# EAGLE schematic HarpyFC (EAGLE 9.5.1)

## Sheet 1 of 2
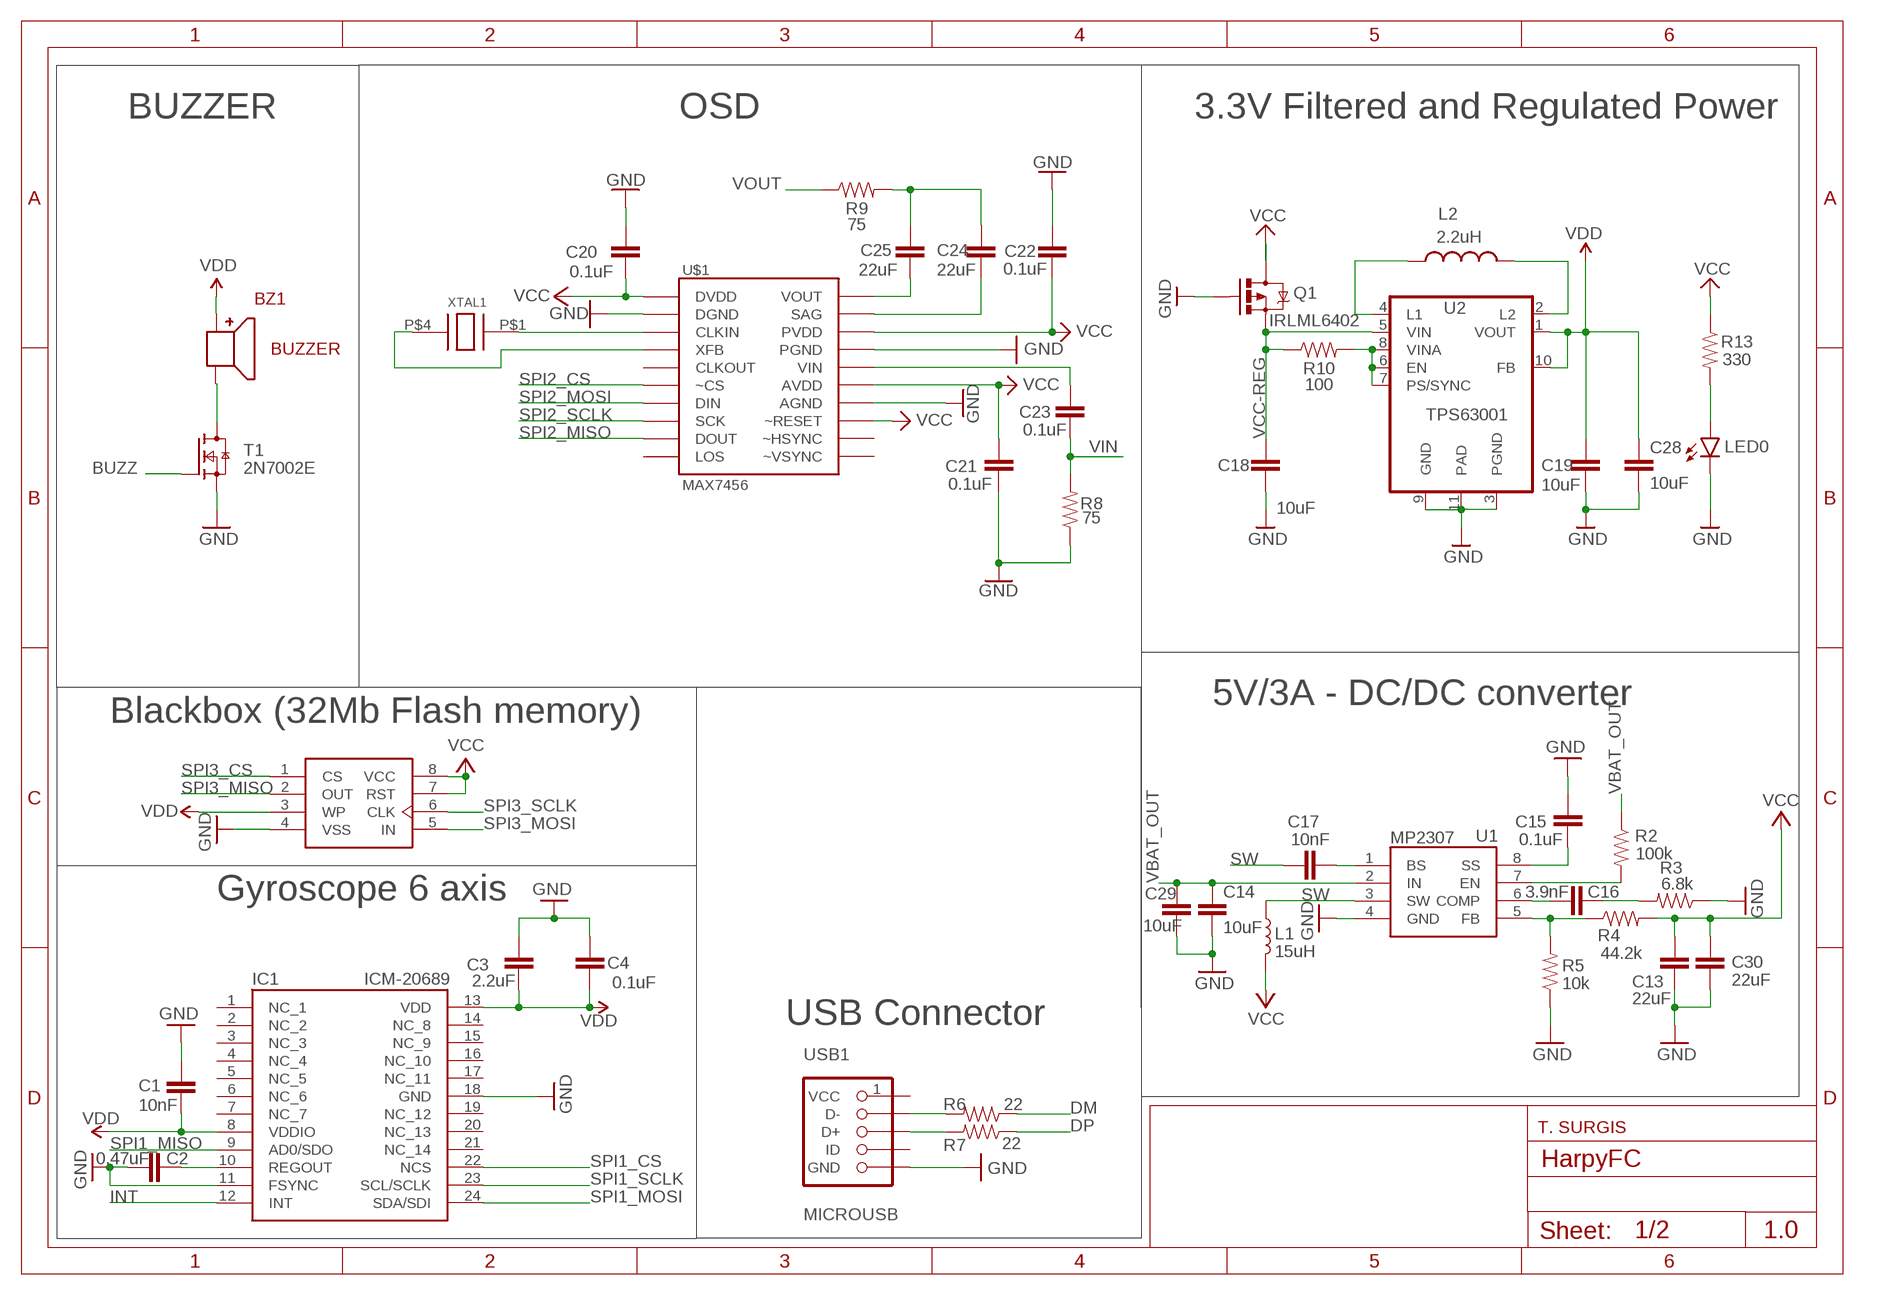
[diagram p0: schematic, sheet 1]

### Parts
BZ1  BUZZER  [CMT-8530S-SMT-TR]
C1  10nF  CAP-0402-TIGHT  [0402-TIGHT]
C2  0.47uF  CAP-0402-TIGHT  [0402-TIGHT]
C3  2.2uF  CAP-0603  [0603]
C4  0.1uF  CAP-0402-TIGHT  [0402-TIGHT]
C13  22uF  CAP-0603  [0603]
C14  10uF  CAP-0603  [0603]
C15  0.1uF  CAP-0402-TIGHT  [0402-TIGHT]
C16  3.9nF  CAP-0402-TIGHT  [0402-TIGHT]
C17  10nF  CAP-0402-TIGHT  [0402-TIGHT]
C18  10uF  CAP-0603  [0603]
C19  10uF  CAP-0603  [0603]
C20  0.1uF  CAP-0402-TIGHT  [0402-TIGHT]
C21  0.1uF  CAP-0402-TIGHT  [0402-TIGHT]
C22  0.1uF  CAP-0402-TIGHT  [0402-TIGHT]
C23  0.1uF  CAP-0402-TIGHT  [0402-TIGHT]
C24  22uF  CAP-0805  [0805]
C25  22uF  CAP-0805  [0805]
C28  10uF  CAP-0603  [0603]
C29  10uF  CAP-0603  [0603]
C30  22uF  CAP-0603  [0603]
IC1  ICM-20689  [ICM20689]
L1  15uH  MPIL0630  [MPIL0630]
L2  2.2uH  DFE201612E-INDUCTOR2.2UH  [DFE201612E-INDUCTOR]
LED0  BLUE  LED  [0805]
Q1  MOSFET-PCHANNEL  [SOT23-3]
R2  100k  RESISTOR  [0402-TIGHT]
R3  6.8k  RESISTOR  [0402-TIGHT]
R4  44.2k  RESISTOR  [0402-TIGHT]
R5  10k  RESISTOR  [0402-TIGHT]
R6  22  RESISTOR  [0402-TIGHT]
R7  22  RESISTOR  [0402-TIGHT]
R8  75  RESISTOR  [0402-TIGHT]
R9  75  RESISTOR  [0402-TIGHT]
R10  100  RESISTOR  [0402-TIGHT]
R13  330  RESISTOR  [0402-TIGHT]
T1  2N7002E  [SOT23]
U1  MP2307  [SOIC8]
U2  TPS63001  TPS630XX-TPS63001  [VSON-N10]
U3  MX25L6406EM2I-12G  M25P32  [M25P32]
U$1  MAX7456  [TSSOP28]
USB1  MICROUSB  [1051330011-SD]
XTAL1  CRYSTAL  [SX32Y027000BA1T]

### Nets
BUZZ: T1.1(G) ; also sheet 2
DM: R6.1 ; also sheet 2
DP: R7.1 ; also sheet 2
GND: C1.1 C2.1 C3.2 C4.2 C13.2 C14.2 C15.2 C18.2 C19.2 C20.2 C21.2 C22.2 C28.2 C29.2 C30.2 IC1.11(FSYNC) IC1.18(GND) LED0.2(C) Q1.1(G) R3.1 R5.1 R8.1 T1.2(S) U1.4(GND) U2.3(PGND) U2.9(GND) U2.11(PAD) U3.4(VSS) U$1.4(DGND) U$1.20(AGND) U$1.23(PGND) USB1.5(GND) USB1.HOLE3(GND) USB1.HOLE4(GND) USB1.HOLE5(GND) ; also sheet 2
INT: IC1.12(INT) ; also sheet 2
L1: L2.P$1 U2.4(L1)
L2: L2.P$2 U2.2(L2)
N$2: C2.2 IC1.10(REGOUT)
N$3: R10.2 U2.6(EN) U2.7(PS/SYNC) U2.8(VINA)
N$13: R2.2 U1.7(EN)
N$14: C15.1 U1.8(SS)
N$15: C16.2 U1.6(COMP)
N$16: C16.1 R3.2
N$17: R4.1 R5.2 U1.5(FB)
N$18: C17.2 U1.1(BS)
N$19: R6.2 USB1.2(D-)
N$20: R7.2 USB1.3(D+)
N$21: BZ1.P$3 T1.3(D)
N$22: U$1.5(CLKIN) XTAL1.P$1
N$23: U$1.6(XFB) XTAL1.P$4
N$26: C23.2 U$1.22(VIN)
N$27: C24.2 U$1.25(SAG)
N$28: C25.2 U$1.26(VOUT)
N$29: C24.1 C25.1 R9.2
N$32: LED0.1(A) R13.2
SPI1_CS: IC1.22(NCS) ; also sheet 2
SPI1_MISO: IC1.9(AD0/SDO) ; also sheet 2
SPI1_MOSI: IC1.24(SDA/SDI) ; also sheet 2
SPI1_SCLK: IC1.23(SCL/SCLK) ; also sheet 2
SPI2_CS: U$1.8(~CS) ; also sheet 2
SPI2_MISO: U$1.11(DOUT) ; also sheet 2
SPI2_MOSI: U$1.9(DIN) ; also sheet 2
SPI2_SCLK: U$1.10(SCK) ; also sheet 2
SPI3_CS: U3.1(CS) ; also sheet 2
SPI3_MISO: U3.2(OUT) ; also sheet 2
SPI3_MOSI: U3.5(IN) ; also sheet 2
SPI3_SCLK: U3.6(CLK) ; also sheet 2
SW: C17.1 L1.P$1 U1.3(SW)
VBAT_OUT: C14.1 C29.1 R2.1 U1.2(IN) ; also sheet 2
VCC: C13.1 C20.1 C21.1 C22.1 C30.1 L1.P$2 Q1.3(D) R4.2 R13.1 U3.7(RST) U3.8(VCC) U$1.3(DVDD) U$1.19(~RESET) U$1.21(AVDD) U$1.24(PVDD) ; also sheet 2
VCC-REG: C18.1 Q1.2(S) R10.1 U2.5(VIN)
VDD: BZ1.P$4 C1.2 C3.1 C4.1 C19.1 C28.1 IC1.8(VDDIO) IC1.13(VDD) U2.1(VOUT) U2.10(FB) U3.3(WP) ; also sheet 2
VIN: C23.1 R8.2 ; also sheet 2
VOUT: R9.1 ; also sheet 2
Unconnected: IC1.1(NC_1) IC1.2(NC_2) IC1.3(NC_3) IC1.4(NC_4) IC1.5(NC_5) IC1.6(NC_6) IC1.7(NC_7) IC1.14(NC_8) IC1.15(NC_9) IC1.16(NC_10) IC1.17(NC_11) IC1.19(NC_12) IC1.20(NC_13) IC1.21(NC_14) U$1.7(CLKOUT) U$1.12(LOS) U$1.17(~VSYNC) U$1.18(~HSYNC) USB1.1(VCC) USB1.4(ID)

### Notes on the sheet
- BUZZER | OSD | 3.3V Filtered and Regulated Power
- IRLML6402
- 5V/3A - DC/DC converter
- Blackbox (32Mb Flash memory)
- MP2307
- Gyroscope 6 axis
- USB Connector
- T. SURGIS
- 1.0

## Sheet 2 of 2
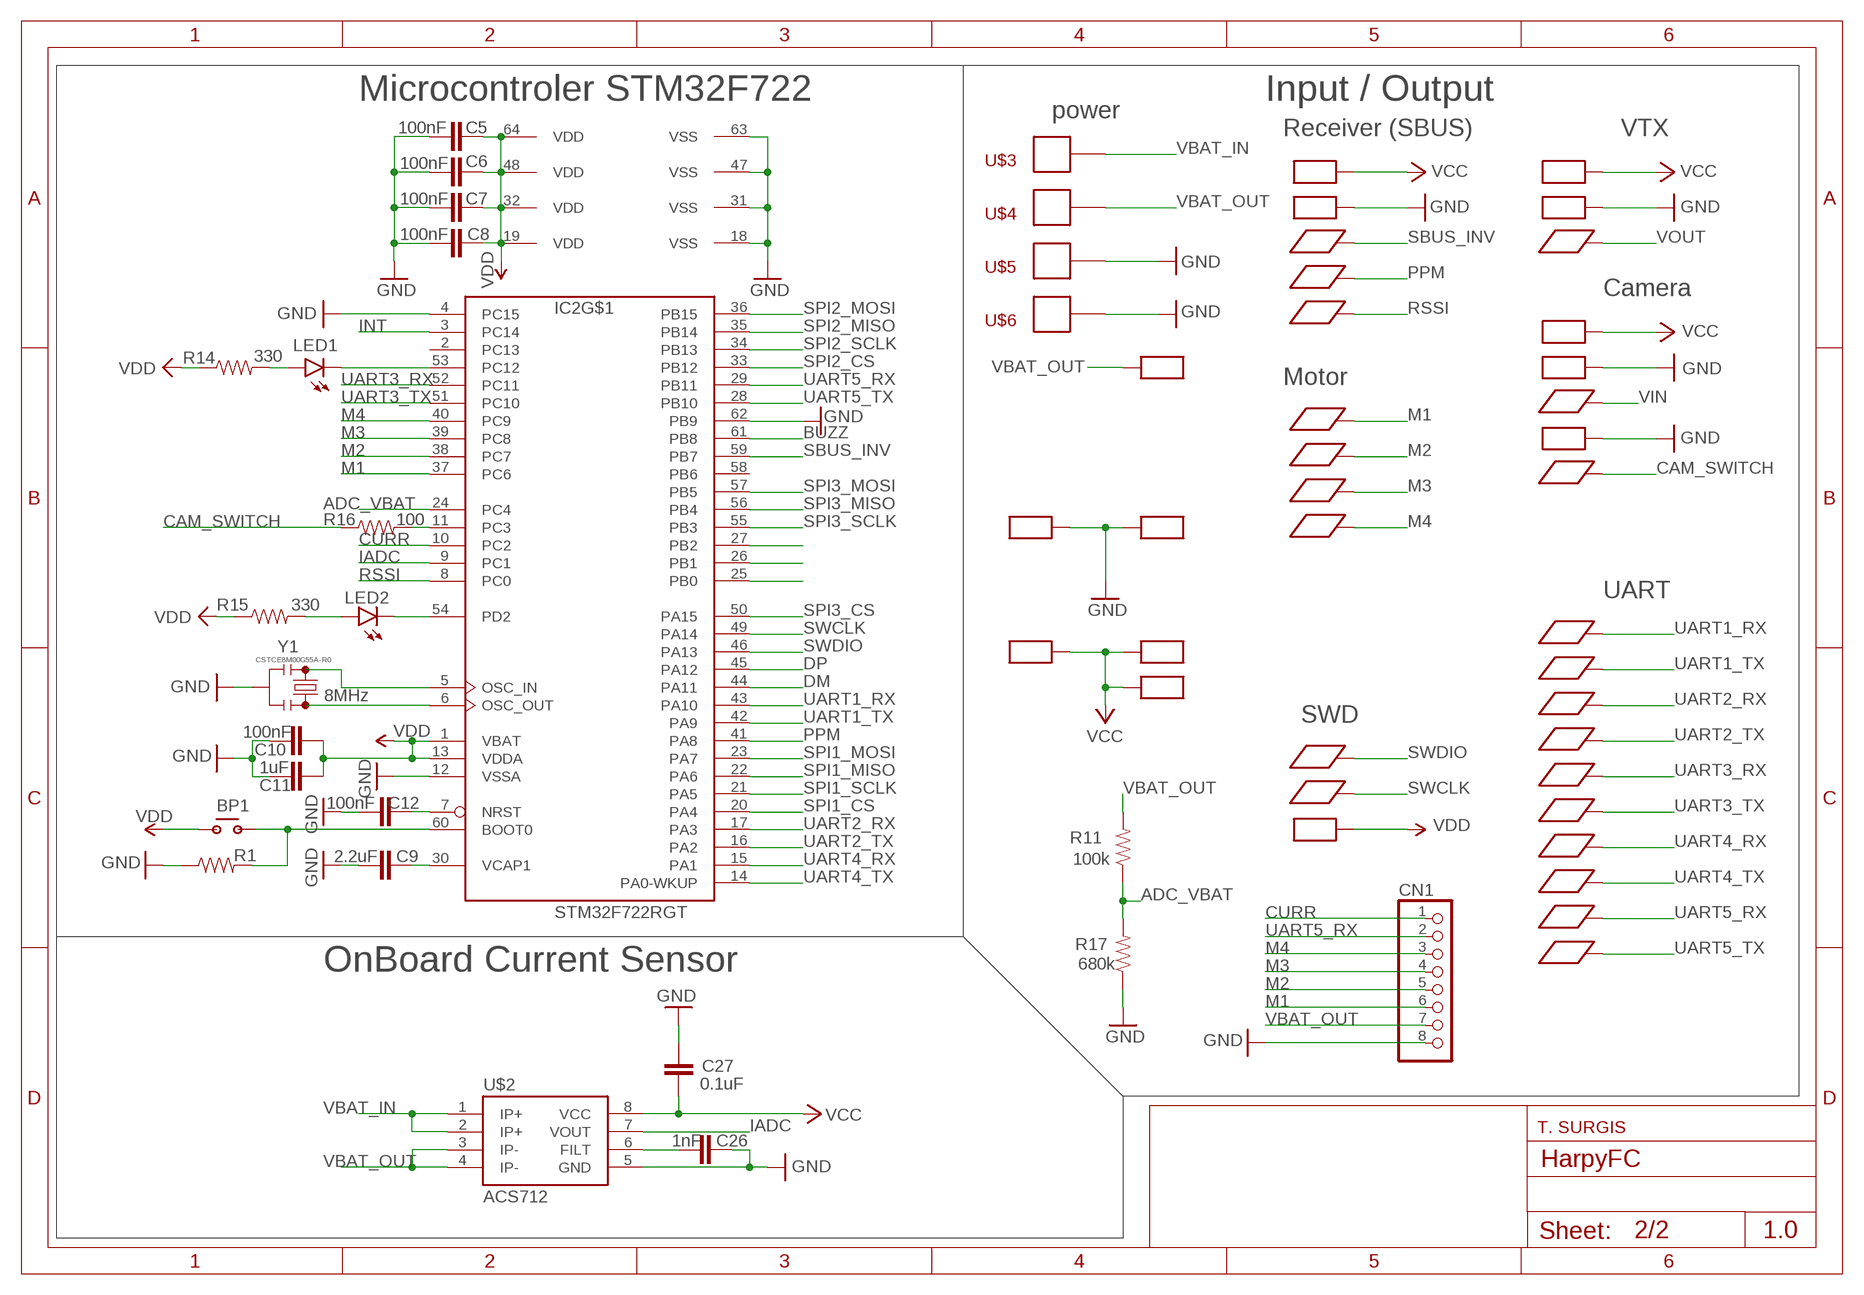
[diagram p1: schematic, sheet 2]

### Parts
BP1  TL3330  [TL3330]
C5  100nF  CAP-0402-TIGHT  [0402-TIGHT]
C6  100nF  CAP-0402-TIGHT  [0402-TIGHT]
C7  100nF  CAP-0402-TIGHT  [0402-TIGHT]
C8  100nF  CAP-0402-TIGHT  [0402-TIGHT]
C9  2.2uF  CAP-0603  [0603]
C10  100nF  CAP-0402-TIGHT  [0402-TIGHT]
C11  1uF  CAP-0402-TIGHT  [0402-TIGHT]
C12  100nF  CAP-0402-TIGHT  [0402-TIGHT]
C26  1nF  CAP-0402-TIGHT  [0402-TIGHT]
C27  0.1uF  CAP-0402-TIGHT  [0402-TIGHT]
CN1  JST_8PINJSTSH8  [JSTSH8]
IC2  STM32F722RGT  [LQFP64]
LED1  BLUE  LED  [0805]
LED2  BLUE  LED  [0805]
P$1  SIGNAL_PAD  [SIGNAL_PAD]
P$2  SIGNAL_PAD  [SIGNAL_PAD]
P$3  SIGNAL_PAD  [SIGNAL_PAD]
P$4  SIGNAL_PAD  [SIGNAL_PAD]
P$5  SIGNAL_PAD  [SIGNAL_PAD]
P$6  SIGNAL_PAD  [SIGNAL_PAD]
P$7  SIGNAL_PAD  [SIGNAL_PAD]
P$12  SIGNAL_PAD  [SIGNAL_PAD]
P$13  SIGNAL_PAD  [SIGNAL_PAD]
P$14  SIGNAL_PAD  [SIGNAL_PAD]
P$15  SIGNAL_PAD  [SIGNAL_PAD]
P$16  SIGNAL_PAD  [SIGNAL_PAD]
P$17  SIGNAL_PAD  [SIGNAL_PAD]
P$18  SIGNAL_PAD  [SIGNAL_PAD]
P$19  SIGNAL_PAD  [SIGNAL_PAD]
P$20  SIGNAL_PAD  [SIGNAL_PAD]
P$21  SIGNAL_PAD  [SIGNAL_PAD]
P$22  SIGNAL_PAD  [SIGNAL_PAD]
P$23  SIGNAL_PAD  [SIGNAL_PAD]
P$24  SIGNAL_PAD  [SIGNAL_PAD]
P$25  SIGNAL_PAD  [SIGNAL_PAD]
P$26  SIGNAL_PAD  [SIGNAL_PAD]
R1  RESISTOR  [0402-TIGHT]
R11  100k  RESISTOR  [0402-TIGHT]
R14  330  RESISTOR  [0402-TIGHT]
R15  330  RESISTOR  [0402-TIGHT]
R16  100  RESISTOR  [0402-TIGHT]
R17  680k  RESISTOR  [0402-TIGHT]
U$2  ACS712  [SO08]
U$3  BATTERY_PAD  [BATTERY_PAD]
U$4  BATTERY_PAD  [BATTERY_PAD]
U$5  BATTERY_PAD  [BATTERY_PAD]
U$6  BATTERY_PAD  [BATTERY_PAD]
U$7  POWER_PAD  [POWER_PAD]
U$8  POWER_PAD  [POWER_PAD]
U$9  POWER_PAD  [POWER_PAD]
U$10  POWER_PAD  [POWER_PAD]
U$11  POWER_PAD  [POWER_PAD]
U$17  POWER_PAD  [POWER_PAD]
U$21  POWER_PAD  [POWER_PAD]
U$32  POWER_PAD  [POWER_PAD]
U$33  POWER_PAD  [POWER_PAD]
U$36  POWER_PAD  [POWER_PAD]
U$37  POWER_PAD  [POWER_PAD]
U$38  POWER_PAD  [POWER_PAD]
U$39  POWER_PAD  [POWER_PAD]
U$40  POWER_PAD  [POWER_PAD]
Y1  8MHz  RESONATOR-8MHZSMD_3.2X1.3  [RESONATOR-SMD-3.2X1.3]

### Nets
ADC_VBAT: IC2.24(PC4) R11.1 R17.2
BUZZ: IC2.61(PB8) ; also sheet 1
CAM_SWITCH: P$24.P$1 R16.1
CURR: CN1.1 IC2.10(PC2)
DM: IC2.44(PA11) ; also sheet 1
DP: IC2.45(PA12) ; also sheet 1
GND: C5.2 C6.2 C7.2 C8.2 C9.2 C10.1 C11.2 C12.1 C26.1 C27.1 CN1.8 IC2.4(PC15) IC2.12(VSSA) IC2.18(VSS) IC2.31(VSS) IC2.47(VSS) IC2.62(PB9) IC2.63(VSS) R1.1 R17.1 U$2.5(GND) U$5.P$1 U$6.P$1 U$8.P$1 U$10.P$1 U$21.P$1 U$32.P$1 U$33.P$1 U$39.P$1 Y1.2 ; also sheet 1
IADC: IC2.9(PC1) U$2.7(VOUT)
INT: IC2.3(PC14) ; also sheet 1
M1: CN1.6 IC2.37(PC6) P$4.P$1
M2: CN1.5 IC2.38(PC7) P$5.P$1
M3: CN1.4 IC2.39(PC8) P$6.P$1
M4: CN1.3 IC2.40(PC9) P$7.P$1
M6: IC2.25(PB0)
M7: IC2.26(PB1)
M8: IC2.27(PB2)
N$1: IC2.11(PC3) R16.2
N$8: IC2.6(OSC_OUT) Y1.3
N$9: C9.1 IC2.30(VCAP1)
N$10: IC2.5(OSC_IN) Y1.1
N$11: BP1.P$4 IC2.60(BOOT0) R1.2
N$12: C12.2 IC2.7(NRST)
N$34: LED1.1(A) R14.2
N$35: IC2.53(PC12) LED1.2(C)
N$36: LED2.1(A) R15.2
N$37: C26.2 U$2.6(FILT)
N$38: IC2.54(PD2) LED2.2(C)
PPM: IC2.41(PA8) P$22.P$1
RSSI: IC2.8(PC0) P$23.P$1
SBUS_INV: IC2.59(PB7) P$3.P$1
SPI1_CS: IC2.20(PA4) ; also sheet 1
SPI1_MISO: IC2.22(PA6) ; also sheet 1
SPI1_MOSI: IC2.23(PA7) ; also sheet 1
SPI1_SCLK: IC2.21(PA5) ; also sheet 1
SPI2_CS: IC2.33(PB12) ; also sheet 1
SPI2_MISO: IC2.35(PB14) ; also sheet 1
SPI2_MOSI: IC2.36(PB15) ; also sheet 1
SPI2_SCLK: IC2.34(PB13) ; also sheet 1
SPI3_CS: IC2.50(PA15) ; also sheet 1
SPI3_MISO: IC2.56(PB4) ; also sheet 1
SPI3_MOSI: IC2.57(PB5) ; also sheet 1
SPI3_SCLK: IC2.55(PB3) ; also sheet 1
SWCLK: IC2.49(PA14) P$26.P$1
SWDIO: IC2.46(PA13) P$25.P$1
UART1_RX: IC2.43(PA10) P$12.P$1
UART1_TX: IC2.42(PA9) P$13.P$1
UART2_RX: IC2.17(PA3) P$14.P$1
UART2_TX: IC2.16(PA2) P$15.P$1
UART3_RX: IC2.52(PC11) P$16.P$1
UART3_TX: IC2.51(PC10) P$17.P$1
UART4_RX: IC2.15(PA1) P$18.P$1
UART4_TX: IC2.14(PA0-WKUP) P$19.P$1
UART5_RX: CN1.2 IC2.29(PB11) P$20.P$1
UART5_TX: IC2.28(PB10) P$21.P$1
VBAT_IN: U$2.1(IP+) U$2.2(IP+) U$3.P$1
VBAT_OUT: CN1.7 R11.2 U$2.3(IP-) U$2.4(IP-) U$4.P$1 U$17.P$1 ; also sheet 1
VCC: C27.2 R14.1 R15.1 U$2.8(VCC) U$7.P$1 U$9.P$1 U$11.P$1 U$36.P$1 U$37.P$1 U$38.P$1 ; supply symbol labelled VDD ; also sheet 1
VDD: BP1.P$3 C5.1 C6.1 C7.1 C8.1 C10.2 C11.1 IC2.1(VBAT) IC2.13(VDDA) IC2.19(VDD) IC2.32(VDD) IC2.48(VDD) IC2.64(VDD) U$40.P$1 ; also sheet 1
VIN: P$1.P$1 ; also sheet 1
VOUT: P$2.P$1 ; also sheet 1
Unconnected: IC2.2(PC13) IC2.58(PB6)

### Notes on the sheet
- Microcontroler STM32F722 | Input / Output
- power
- Receiver (SBUS) | VTX
- Camera
- Motor
- UART
- CSTCE8M00G55A-R0
- SWD
- OnBoard Current Sensor
- T. SURGIS
- 1.0

## Library data of the parts
BP1 = HarpyFC_Library:TL3330
BZ1 = HarpyFC_Library:BUZZER
C1-C30 = HarpyFC_Library:CAP
CN1 = HarpyFC_Library:JST_8PIN: JST 8-Pin Right-Angle Connector
IC1 = HarpyFC_Library:ICM-20689: IMUs - Inertial Measurement Units 6-Axis DMP-Enabled Drone/VR/IoT solution, Targeted For All Current MPU-6000/6050 Users Source: Datasheet <http://www.invensense.com/wp-content/uploads/2017/08/ICM-20689-v2.2-002.pdf>; DESCRIPTION: IMUs - Inertial Measurement Units 6-Axis DMP-Enabled Drone/VR/IoT solution, Targeted For All Current MPU-6000/6050 Users; HEIGHT: 1mm; MANUFACTURER_NAME: InvenSense Inc.; MANUFACTURER_PART_NUMBER: ICM-20689; MOUSER_PART_NUMBER: 410-ICM-20689; MOUSER_PRICE-STOCK: https://www.mouser.com/Search/Refine.aspx?Keyword=410-ICM-20689
IC2 = HarpyFC_Library:STM32F722R*T: ARM 32-bit Cortex™-M7 CPU 216 MHz maximum frequency 512 Kbytes of Flash memory 256 kbytes of SRAM 50 GPIOs 1.8 to 3.6 V application supply
L1 = HarpyFC_Library:MPIL0630: ECS-MPIL0530 SMT Power inductor series : Datasheet : https://ecsxtal.com/store/pdf/ECS-MPIL0630-SMD-POWER-INDUCTOR.pdf Values : 0.47uH 0.68 uH 0.82 uH 1.0 uH 1.5 uH 2.2 uH 3.3 uH 4.7 uH 6.8 uH 10 uH 15 uH 22 uH
L2 = HarpyFC_Library:DFE201612E-INDUCTOR: Murata Fixed Inductors 0806 2.2uH 20% 2.4A RDC=0.116ohms; MF: Murata; MPN: DFE201612E-2R2M=P2; PARTNO: DFE201612E-2R2M-P2
LED0 LED1 LED2 = HarpyFC_Library:LED: LED (Generic) Standard schematic elements and footprints for 5mm, 3mm, 1206, and 0603 sized LEDs. Generic LEDs with no color specified.
P$1-P$7 P$12-P$26 = HarpyFC_Library:SIGNAL_PAD
Q1 = HarpyFC_Library:MOSFET-PCHANNEL: Generic PMOSFET IRLML2244 - TRANS-11153 (SOT-23 -20V -4.3A) (1.Gate 2.Source 3.Drain) FQP27P06 - COM-10349 <http://www.sparkfun.com/products/10349> (TO-220 -60V -27A) (1.Gate 2.Source 3.Drain); PROD_ID: TRANS-08285
R1-R11 R13-R17 = HarpyFC_Library:RESISTOR: Generic Resistor Package
T1 = HarpyFC_Library:2N7002: N-channel TrenchMOS FET N-channel enhancement mode Field-Effect Transistor (FET) in a plastic package using TrenchMOS technology. AAL Eindhoven MK
U1 = HarpyFC_Library:MP2307: MP2307 Step-Down Converter 3A Continuous Output Current 4A Peak Output Current Wide 4.75V to 23V Operationg Input Range Output Adjustable from 0.925V to 20V Up to 95% efficiency Fixed 340kHz Frequency Datasheet : https://cdn-shop.adafruit.com/datasheets/MP2307_r1.9.pdf
U2 = HarpyFC_Library:TPS630XX: Buck/Boost Converter TPS63001/2 Datasheet <http://www.ti.com/lit/ds/symlink/tps63001.pdf> Author: Lance Source: http://alienflight.com License: CC BY SA <creativecommons.org/licenses/by-sa/4.0/>; MF: TI; MPN: TPS63001DRCR
U3 = HarpyFC_Library:M25P32: Dataflash; PARTNO: MX25L6406EM2I-12G
U$1 = HarpyFC_Library:MAX7456: Monochrome NTSC/PAL on-screen display generator (SPI)
U$2 = HarpyFC_Library:ACS712: ACS712 Hall-effect-based isolated linear current sensor Datasheet <http://www.sparkfun.com/datasheets/BreakoutBoards/0712.pdf> SparkFun Products SparkFun Low Current Sensor Breakout - ACS712 <https://www.sparkfun.com/products/8883> (SEN-08883); PROD_ID: IC-08964
U$3-U$6 = HarpyFC_Library:BATTERY_PAD
U$7-U$11 U$17 U$21 U$32 U$33 U$36-U$40 = HarpyFC_Library:POWER_PAD
USB1 = HarpyFC_Library:MICROUSB: Molex USB Connectors uUSB B Rec Vertical TH 2.30
XTAL1 = HarpyFC_Library:CRYSTAL
Y1 = HarpyFC_Library:RESONATOR-8MHZ: 8MHz Resonator Digikey Example <http://www.digikey.com/product-detail/en/murata-electronics-north-america/CSTCE10M0G55-R0/490-1196-1-ND/584633> Frequency: 8MHz Frequency Stability: ±0.2% Frequency Tolerance: ±0.5% Capacitance: 33pF SparkFun Products Arduino Pro Mini 328- 3.3V/8MHz <https://www.sparkfun.com/products/11114> SparkFun Digital Sandbox <https://www.sparkfun.com/products/12651>; PROD_ID: XTAL-08895